# Altium schematic sheet Copy of MCU_32.SchDoc: MCU
size A4; DocumentNumber: MB1180; Revision: C.1; SheetNumber: 2; SheetTotal: 3; Project: NUCLEO32
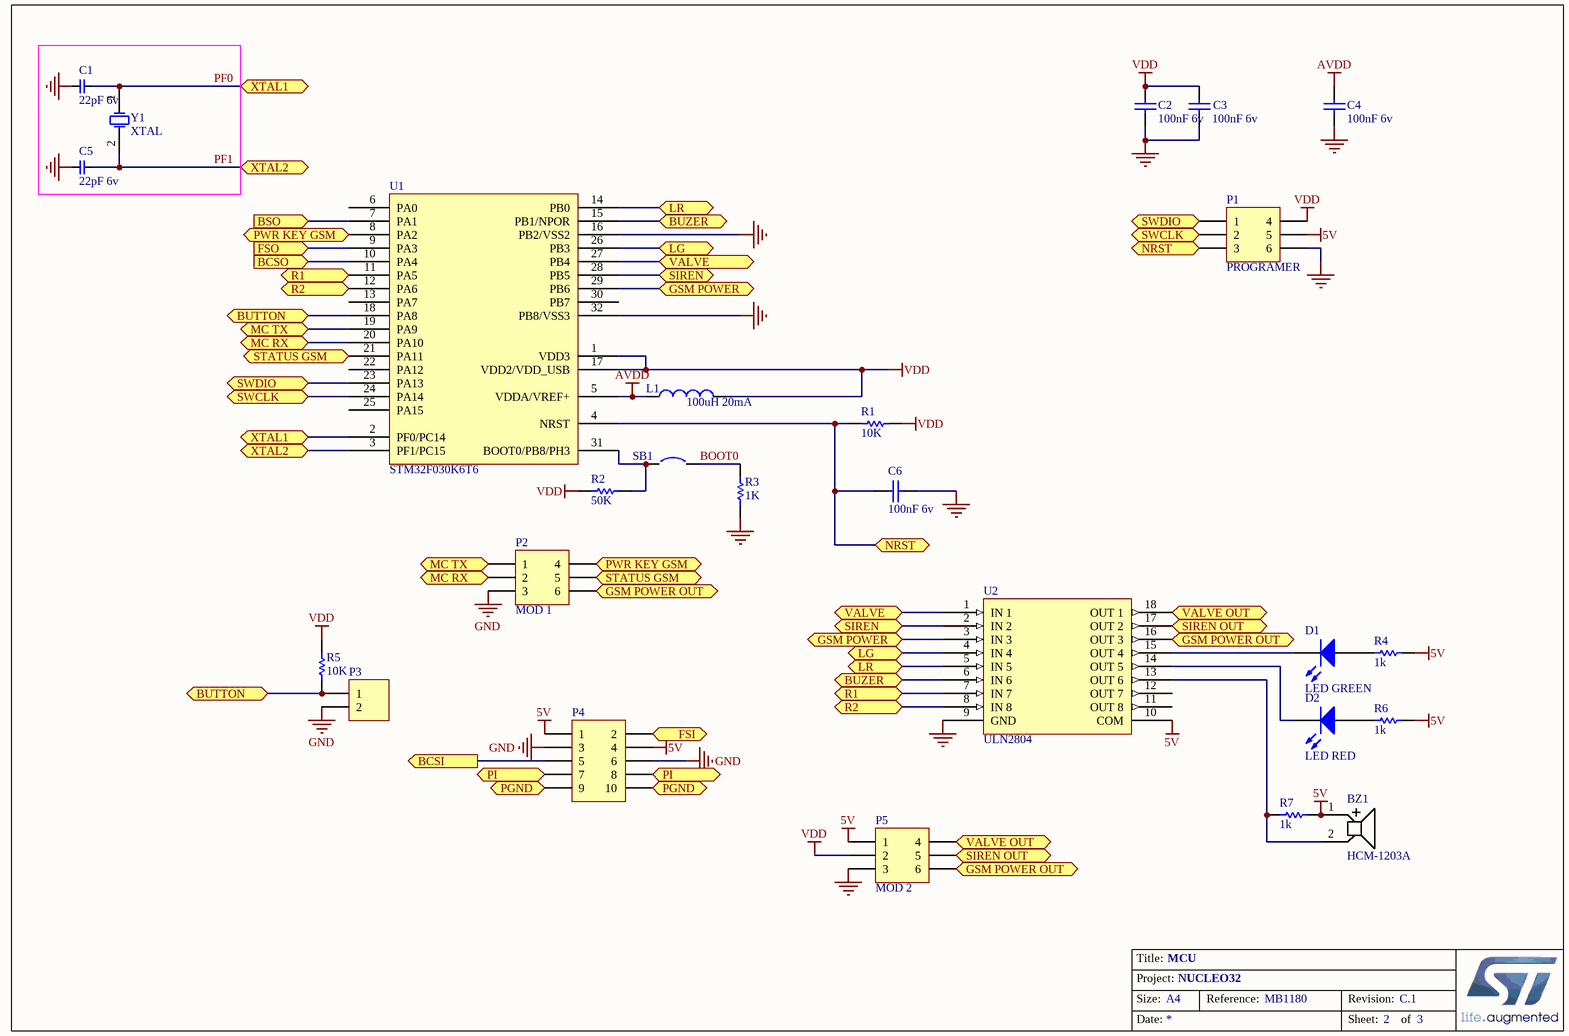
[diagram p0: Copy of MCU_32.SchDoc]

## Parts
BZ1  HCM-1203A  [HCM-1203A]
C1  22pF 6v  [CAP0603]
C2  100nF 6v  [0603C]
C3  100nF 6v  [0603C]
C4  100nF 6v  [0603C]
C5  22pF 6v  [CAP0603]
C6  100nF 6v  [0603C]
D1  LED GREEN  [My Green Led]
D2  LED RED  [My_LED3MM]
L1  100uH 20mA  [0603L]
P1  PROGRAMER  [HDR2X3_CEN]
P2  MOD 1  [HDR2X3_CEN]
P3  MHDR1X2  [HDR1X2]  (value not drawn)
P4  Header 5X2  [HDR2X5]  (value not drawn)
P5  MOD 2  [HDR2X3_CEN]
R1  10K  [0603R]
R2  50K  [0603R]
R3  1K  [0603R]
R4  1k  [RES 1206/3216]
R5  10K  [0603R]
R6  1k  [RES 1206/3216]
R7  1k  [RES 1206/3216]
SB1  Circuit Breaker  [SB_0603]  (value not drawn)
U1  STM32F030K6T6  [LQFP32_0R5_7x7]
U2  ULN2804  [SOL-18_N]
Y1  XTAL  [3SMXA]

## Ports
BCSI (out), BCSO (in), BSO (in), BUTTON, BUZER (bidir), FSI (out), FSO (in), GSM POWER (bidir), GSM POWER OUT (out), LG (bidir), LR (bidir), MC RX (bidir), MC TX (bidir), NRST, PGND (bidir), PI (bidir), PWR KEY GSM (bidir), R1 (bidir), R2 (bidir), SIREN (bidir), SIREN OUT (out), STATUS GSM (bidir), SWCLK, SWDIO, VALVE (bidir), VALVE OUT (out), XTAL1 (bidir), XTAL2 (bidir)

## Nets
5V: BZ1.1 P1.5 P4.1 P4.4 P5.1 R4.2 R6.2 R7.1 U2.10(COM)
AVDD: C4.1 L1.1 U1.5(VDDA/VREF+)
GND: C1.2 C2.2 C3.2 C4.2 C5.2 C6.1 P1.6 P2.3 P3.2 P4.3 P4.6 P5.3 R3.2 U1.16(PB2/VSS2) U1.32(PB8/VSS3) U2.9(GND)
VDD: C2.1 C3.1 L1.2 P1.4 P5.2 R1.1 R2.2 R5.1 U1.1(VDD3) U1.17(VDD2/VDD_USB)
BCSI: P4.5 ; port BCSI
BCSO: U1.10(PA4) ; port BCSO
BOOT0: R3.1 SB1.2
BSO: U1.7(PA1) ; port BSO
BUTTON: P3.1 R5.2 U1.18(PA8) ; port BUTTON
BUZER: U1.15(PB1/NPOR) U2.6(IN_6) ; port BUZER
FSI: P4.2 ; port FSI
FSO: U1.9(PA3) ; port FSO
GSM POWER: U1.29(PB6) U2.3(IN_3) ; port GSM POWER
GSM POWER OUT: P2.6 P5.6 U2.16(OUT_3) ; port GSM POWER OUT
LG: U1.26(PB3) U2.4(IN_4) ; port LG
LR: U1.14(PB0) U2.5(IN_5) ; port LR
MC RX: P2.2 U1.20(PA10) ; port MC RX
MC TX: P2.1 U1.19(PA9) ; port MC TX
NRST: C6.2 P1.3 R1.2 U1.4(NRST) ; port NRST
PF0: C1.1 U1.2(PF0/PC14) Y1.1(OSC1) ; port XTAL1
PF1: C5.1 U1.3(PF1/PC15) Y1.2(OSC2) ; port XTAL2
PGND: P4.9 P4.10 ; port PGND
PI: P4.7 P4.8 ; port PI
PWR KEY GSM: P2.4 U1.8(PA2) ; port PWR KEY GSM
R1: U1.11(PA5) U2.7(IN_7) ; port R1
R2: U1.12(PA6) U2.8(IN_8) ; port R2
SIREN: U1.28(PB5) U2.2(IN_2) ; port SIREN
SIREN OUT: P5.5 U2.17(OUT_2) ; port SIREN OUT
STATUS GSM: P2.5 U1.21(PA11) ; port STATUS GSM
SWCLK: P1.2 U1.24(PA14) ; port SWCLK
SWDIO: P1.1 U1.23(PA13) ; port SWDIO
VALVE: U1.27(PB4) U2.1(IN_1) ; port VALVE
VALVE OUT: P5.4 U2.18(OUT_1) ; port VALVE OUT
NetBZ1_2: BZ1.2 R7.2 U2.13(OUT_6)
NetD1_A: D1.A R4.1
NetD1_K: D1.K U2.15(OUT_4)
NetD2_A: D2.A R6.1
NetD2_K: D2.K U2.14(OUT_5)
NetR2_1: R2.1 SB1.1 U1.31(BOOT0/PB8/PH3)

Not connected (* = marked no-connect by the designer): U1 6(PA0) 13(PA7) 22(PA12) 25(PA15) 30(PB7); U2 11(OUT_8) 12(OUT_7)

## Notes on the sheet
- Title:
- Project:
- Size:
- Date:
- A4
- Reference:
- Sheet:
- Revision:
- of

## Library data of the parts
BZ1 = HCM-1203A: HCM-1203A buzzer
C1 C5 = Capacitor_np: Value: 22pF 5v
C2 = Cap: Capacitor 100nF 5v; Value: 10nF; Published: 8-Jun-2000; Revision: July-2002: Re-released for DXP Platform.; Publisher: Altium Limited
C3 C4 = Cap: Capacitor; Value: 10nF; Published: 8-Jun-2000; Revision: July-2002: Re-released for DXP Platform.; Publisher: Altium Limited
C6 = CAP: Capacitor; Value: 100pF; Published: 8-Jun-2000; Revision: July-2002: Re-released for DXP Platform.; Publisher: Altium Limited
D1 D2 = LED3m: Typical INFRARED GaAs LED; Published: 8-Jun-2000; LatestRevisionDate: 08-Jul-2005; LatestRevisionNote: Mech Layer 1 removed.; Publisher: Altium Limited
L1 = Inductor: Published: 8-Jun-2000; Revision: July-2002: Re-released for DXP Platform.; Publisher: Altium Limited; Value: 100uH
P1 P2 P5 = Header 3X2A: Header, 3-Pin, Dual row; LatestRevisionDate: 17-Jul-2002; LatestRevisionNote: Re-released for DXP Platform.; Publisher: Altium Limited
P3 = MHDR1X2: Header, 2-Pin; LatestRevisionDate: 17-Jul-2002; LatestRevisionNote: Re-released for DXP Platform.; Publisher: Altium Limited
P4 = Header 5X2: Header, 5-Pin, Dual row; LatestRevisionDate: 17-Jul-2002; LatestRevisionNote: Re-released for DXP Platform.; Publisher: Altium Limited
R1 R2 R5 = Res1: Resistor; Value: 1K; Published: 8-Jun-2000; Revision: July-2002: Re-released for DXP Platform.; Publisher: Altium Limited
R3 = res1: Resistor; Published: 8-Jun-2000; Revision: July-2002: Re-released for DXP Platform.; Publisher: Altium Limited; Value: 1K
R4 R6 R7 = Resistor1: Resistor; Value: =Value
SB1 = Circuit Breaker: Solder: NO; Published: 24-Mar-1999; Revision: July-2002: Re-released for DXP Platform.; Publisher: Altium Limited
U1 = MCU_LQFP32: Type: STM32F030K6T6
U2 = ULN2803: HIGH-VOLTAGE,HIGH-CURRENT DARLINTON ARRAYS
Y1 = XTAL: Crystal Oscillator 0.197" L x 0.126" W (5.00mm x 3.20mm); Published: 8-Jun-2000; LatestRevisionDate: 17-Jul-2002; LatestRevisionNote: Re-released for DXP Platform.; PackageReference: R38; Publisher: Altium Limited; PackageDescription: Crystal, Thru-Hole; 2 Leads; Body 3.1 x 8.2 mm (Dia.xH)